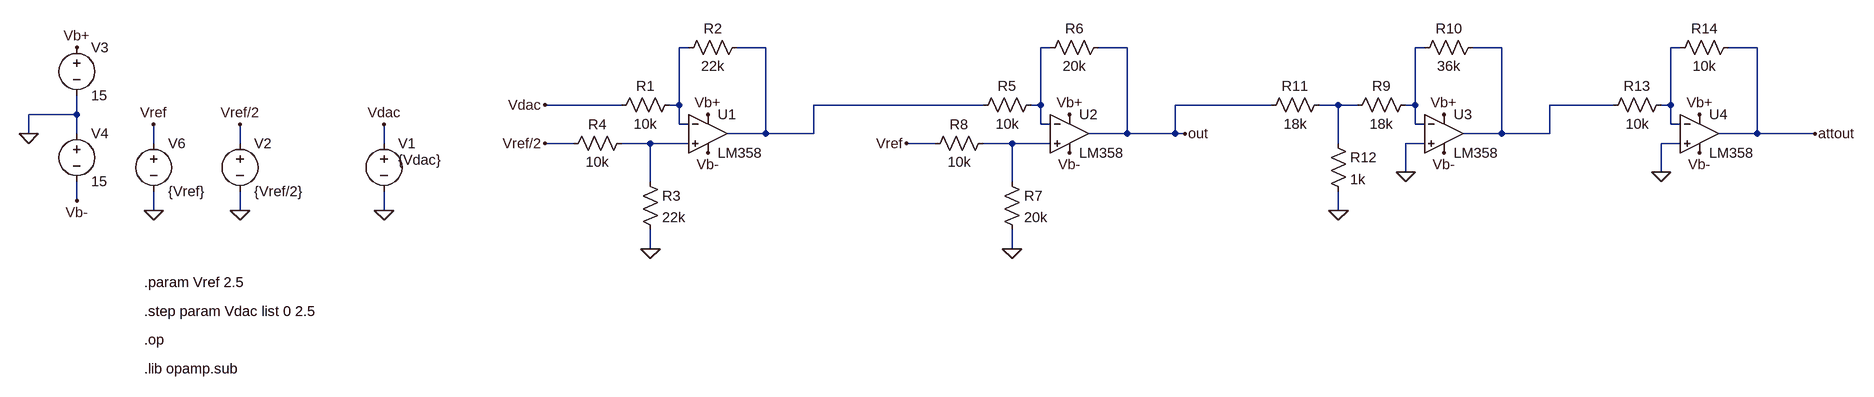
[diagram p0: schematic dac-out-10v.asc]
dac-out-10v.asc, the LTspice schematic file:
Version 4
SHEET 1 3260 1540
WIRE 704 -32 688 -32
WIRE 832 -32 784 -32
WIRE 1440 -32 1424 -32
WIRE 1568 -32 1520 -32
WIRE 2144 -32 2128 -32
WIRE 2272 -32 2224 -32
WIRE 2720 -32 2704 -32
WIRE 2848 -32 2800 -32
WIRE 592 64 464 64
WIRE 688 64 688 -32
WIRE 688 64 672 64
WIRE 1328 64 912 64
WIRE 1424 64 1424 -32
WIRE 1424 64 1408 64
WIRE 1888 64 1648 64
WIRE 2000 64 1968 64
WIRE 2032 64 2000 64
WIRE 2128 64 2128 -32
WIRE 2128 64 2112 64
WIRE 2608 64 2352 64
WIRE 2704 64 2704 -32
WIRE 2704 64 2688 64
WIRE -336 80 -336 48
WIRE -336 80 -416 80
WIRE 688 96 688 64
WIRE 704 96 688 96
WIRE 1424 96 1424 64
WIRE 1440 96 1424 96
WIRE 2128 96 2128 64
WIRE 2144 96 2128 96
WIRE 2704 96 2704 64
WIRE 2720 96 2704 96
WIRE -416 112 -416 80
WIRE -336 112 -336 80
WIRE 832 112 832 -32
WIRE 832 112 768 112
WIRE 912 112 912 64
WIRE 912 112 832 112
WIRE 1568 112 1568 -32
WIRE 1568 112 1504 112
WIRE 1648 112 1648 64
WIRE 1648 112 1568 112
WIRE 1664 112 1648 112
WIRE 2272 112 2272 -32
WIRE 2272 112 2208 112
WIRE 2352 112 2352 64
WIRE 2352 112 2272 112
WIRE 2848 112 2848 -32
WIRE 2848 112 2784 112
WIRE 2944 112 2848 112
WIRE -208 128 -208 96
WIRE -64 128 -64 96
WIRE 176 128 176 96
WIRE 512 128 464 128
WIRE 640 128 592 128
WIRE 704 128 640 128
WIRE 1248 128 1200 128
WIRE 1376 128 1328 128
WIRE 1440 128 1376 128
WIRE 2000 128 2000 64
WIRE 2144 128 2112 128
WIRE 2720 128 2688 128
WIRE 2112 176 2112 128
WIRE 2688 176 2688 128
WIRE 640 192 640 128
WIRE 1376 192 1376 128
WIRE -336 224 -336 192
WIRE -208 240 -208 208
WIRE -64 240 -64 208
WIRE 176 240 176 208
WIRE 2000 240 2000 208
WIRE 640 304 640 272
WIRE 1376 304 1376 272
FLAG 176 240 0
FLAG 176 96 Vdac
FLAG -64 240 0
FLAG -64 96 Vref/2
FLAG -416 112 0
FLAG -336 224 Vb-
FLAG -336 -32 Vb+
FLAG -208 240 0
FLAG -208 96 Vref
FLAG 736 80 Vb+
FLAG 736 144 Vb-
FLAG 464 128 Vref/2
FLAG 464 64 Vdac
FLAG 640 304 0
FLAG 1664 112 out
FLAG 1472 80 Vb+
FLAG 1472 144 Vb-
FLAG 1200 128 Vref
FLAG 1376 304 0
FLAG 2944 112 attout
FLAG 2176 80 Vb+
FLAG 2176 144 Vb-
FLAG 2112 176 0
FLAG 2000 240 0
FLAG 2752 80 Vb+
FLAG 2752 144 Vb-
FLAG 2688 176 0
SYMBOL voltage 176 112 R0
WINDOW 3 24 44 Left 2
WINDOW 123 0 0 Left 2
WINDOW 39 0 0 Left 2
SYMATTR Value {Vdac}
SYMATTR InstName V1
SYMBOL voltage -64 112 R0
WINDOW 123 0 0 Left 2
WINDOW 39 0 0 Left 2
SYMATTR InstName V2
SYMATTR Value {Vref/2}
SYMBOL voltage -336 -48 R0
WINDOW 123 0 0 Left 2
WINDOW 39 0 0 Left 2
SYMATTR InstName V3
SYMATTR Value 15
SYMBOL voltage -336 96 R0
WINDOW 123 0 0 Left 2
WINDOW 39 0 0 Left 2
SYMATTR InstName V4
SYMATTR Value 15
SYMBOL voltage -208 112 R0
WINDOW 123 0 0 Left 2
WINDOW 39 0 0 Left 2
SYMATTR InstName V6
SYMATTR Value {Vref}
SYMBOL res 576 80 R270
WINDOW 0 32 56 VTop 2
WINDOW 3 0 56 VBottom 2
SYMATTR InstName R1
SYMATTR Value 10k
SYMBOL res 688 -16 R270
WINDOW 0 32 56 VTop 2
WINDOW 3 0 56 VBottom 2
SYMATTR InstName R2
SYMATTR Value 22k
SYMBOL Opamps\\LM358 736 48 R0
SYMATTR InstName U1
SYMBOL res 624 176 R0
SYMATTR InstName R3
SYMATTR Value 22k
SYMBOL res 496 144 R270
WINDOW 0 32 56 VTop 2
WINDOW 3 0 56 VBottom 2
SYMATTR InstName R4
SYMATTR Value 10k
SYMBOL res 1312 80 R270
WINDOW 0 32 56 VTop 2
WINDOW 3 0 56 VBottom 2
SYMATTR InstName R5
SYMATTR Value 10k
SYMBOL res 1424 -16 R270
WINDOW 0 32 56 VTop 2
WINDOW 3 0 56 VBottom 2
SYMATTR InstName R6
SYMATTR Value 20k
SYMBOL Opamps\\LM358 1472 48 R0
SYMATTR InstName U2
SYMBOL res 1360 176 R0
SYMATTR InstName R7
SYMATTR Value 20k
SYMBOL res 1232 144 R270
WINDOW 0 32 56 VTop 2
WINDOW 3 0 56 VBottom 2
SYMATTR InstName R8
SYMATTR Value 10k
SYMBOL res 2016 80 R270
WINDOW 0 32 56 VTop 2
WINDOW 3 0 56 VBottom 2
SYMATTR InstName R9
SYMATTR Value 18k
SYMBOL res 2128 -16 R270
WINDOW 0 32 56 VTop 2
WINDOW 3 0 56 VBottom 2
SYMATTR InstName R10
SYMATTR Value 36k
SYMBOL Opamps\\LM358 2176 48 R0
SYMATTR InstName U3
SYMBOL res 1872 80 R270
WINDOW 0 32 56 VTop 2
WINDOW 3 0 56 VBottom 2
SYMATTR InstName R11
SYMATTR Value 18k
SYMBOL res 1984 112 R0
SYMATTR InstName R12
SYMATTR Value 1k
SYMBOL res 2592 80 R270
WINDOW 0 32 56 VTop 2
WINDOW 3 0 56 VBottom 2
SYMATTR InstName R13
SYMATTR Value 10k
SYMBOL res 2704 -16 R270
WINDOW 0 32 56 VTop 2
WINDOW 3 0 56 VBottom 2
SYMATTR InstName R14
SYMATTR Value 10k
SYMBOL Opamps\\LM358 2752 48 R0
SYMATTR InstName U4
TEXT -224 504 Left 2 !.lib opamp.sub
TEXT -224 456 Left 2 !.op
TEXT -224 408 Left 2 !.step param Vdac list 0 2.5
TEXT -224 360 Left 2 !.param Vref 2.5

The netlist it stands for:
* dac-out-10v.asc
V1 Vdac 0 {Vdac}
V2 Vref/2 0 {Vref/2}
V3 Vb+ 0 15
V4 0 Vb- 15
V6 Vref 0 {Vref}
R1 Vdac N001 10k
R2 N001 N002 22k
XU1 N008 N001 Vb+ Vb- N002 LM358  ; pins In+ In- V+ V- OUT
R3 N008 0 22k
R4 Vref/2 N008 10k
R5 N002 N003 10k
R6 N003 out 20k
XU2 N009 N003 Vb+ Vb- out LM358  ; pins In+ In- V+ V- OUT
R7 N009 0 20k
R8 Vref N009 10k
R9 N007 N004 18k
R10 N004 N005 36k
XU3 0 N004 Vb+ Vb- N005 LM358  ; pins In+ In- V+ V- OUT
R11 out N007 18k
R12 N007 0 1k
R13 N005 N006 10k
R14 N006 attout 10k
XU4 0 N006 Vb+ Vb- attout LM358  ; pins In+ In- V+ V- OUT
.lib opamp.sub
.op
.step param Vdac list 0 2.5
.param Vref 2.5
.backanno
.end